# Altium schematic sheet Input&messenger.SchDoc
size A4
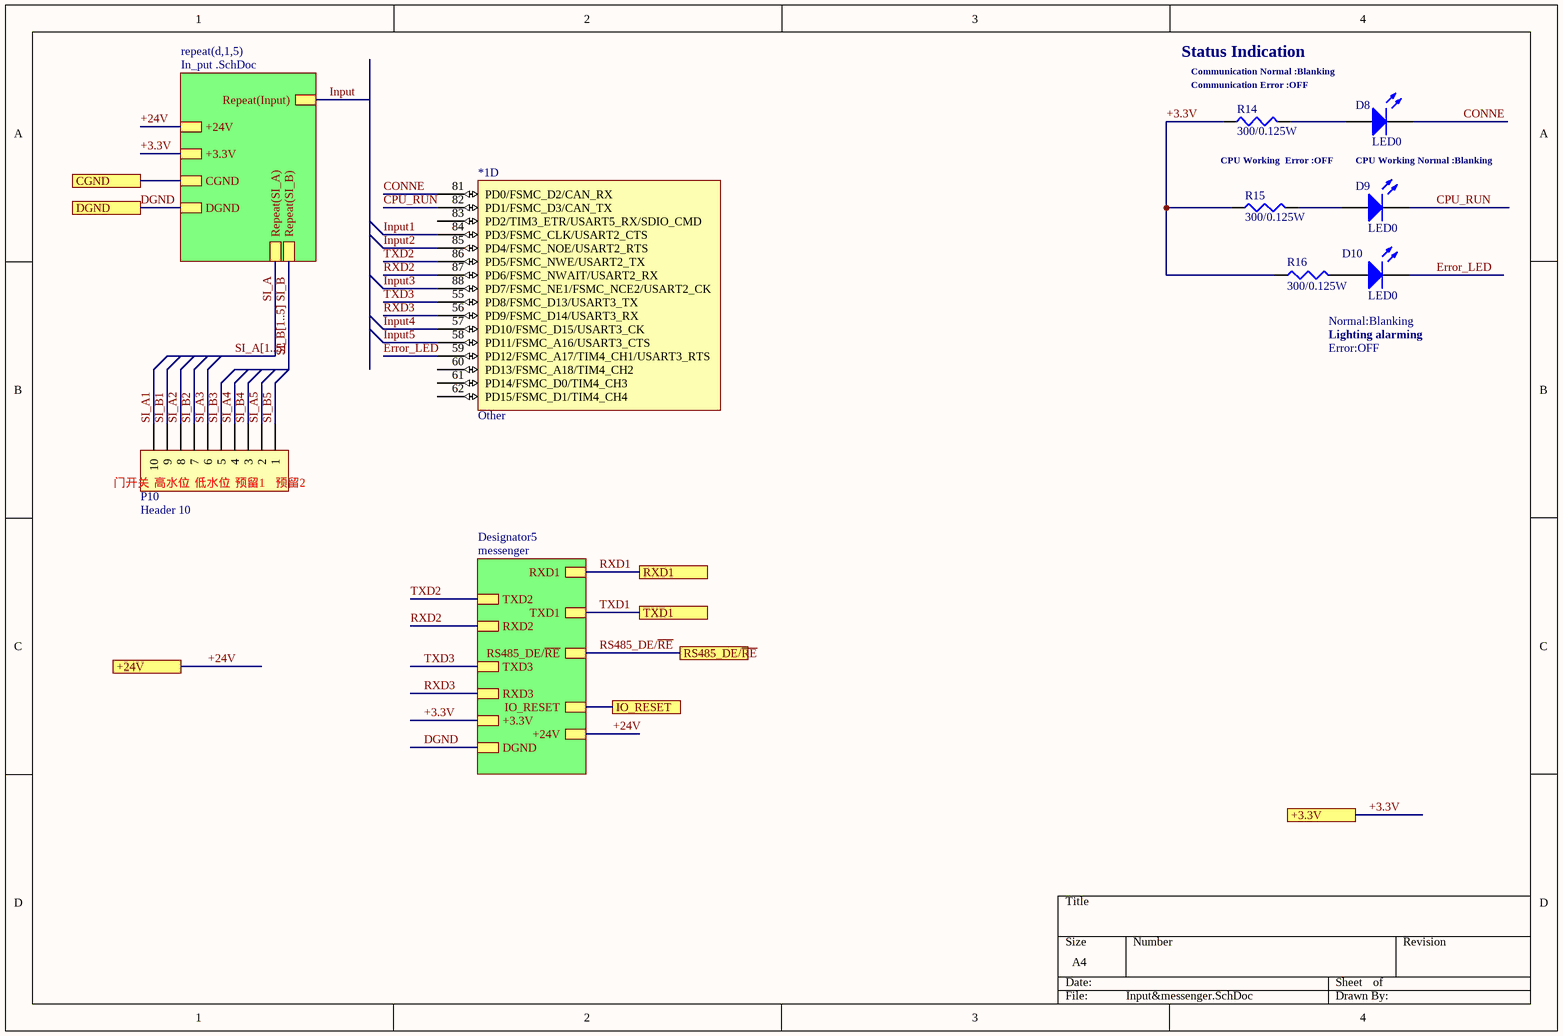
[diagram p0: Input&messenger.SchDoc]

## Parts
*1  Other  [STM-LQFP100_N]  (part D of 6)
D8  LED0  [0805LED]
D9  LED0  [0805LED]
D10  LED0  [0805LED]
P10  Header 10  [CONN-TH-KF7.62-10P]
R14  300/0.125W  [0805R]
R15  300/0.125W  [0805R]
R16  300/0.125W  [0805R]

## Sub-sheets
Designator5 = messenger: TXD2, RXD2, TXD3, RXD3, +3.3V, DGND, RXD1, TXD1, RS485_DE/~{RE}, +24V, IO_RESET
repeat(d,1,5) = In_put .SchDoc: Repeat(Input), +3.3V, CGND, DGND, +24V, Repeat(SI_A), Repeat(SI_B)

## Ports
+3.3V, +24V, CGND, DGND, IO_RESET, RS485_DE/~{RE}, RXD1, TXD1

## Nets
+3.3V: R14.1 R15.1 R16.1 ; port +3.3V, sheet repeat(d,1,5)/+3.3V, sheet Designator5/+3.3V
+24V: port +24V, sheet repeat(d,1,5)/+24V, sheet Designator5/+24V
CGND: port CGND, sheet repeat(d,1,5)/CGND
CONNE: *1.81(PD0/FSMC_D2/CAN_RX) D8.2(K)
CPU_RUN: *1.82(PD1/FSMC_D3/CAN_TX) D9.2(K)
DGND: port DGND, sheet repeat(d,1,5)/DGND, sheet Designator5/DGND
Error_LED: *1.59(PD12/FSMC_A17/TIM4_CH1/USART3_RTS) D10.2(K)
Input: sheet repeat(d,1,5)/Repeat(Input)
Input1: *1.84(PD3/FSMC_CLK/USART2_CTS)
Input2: *1.85(PD4/FSMC_NOE/USART2_RTS)
Input3: *1.88(PD7/FSMC_NE1/FSMC_NCE2/USART2_CK)
Input4: *1.57(PD10/FSMC_D15/USART3_CK)
Input5: *1.58(PD11/FSMC_A16/USART3_CTS)
IO_RESET: port IO_RESET, sheet Designator5/IO_RESET
RS485_DE/~{RE}: port RS485_DE/~{RE}, sheet Designator5/RS485_DE/~{RE}
RXD1: port RXD1, sheet Designator5/RXD1
RXD2: *1.87(PD6/FSMC_NWAIT/USART2_RX) ; sheet Designator5/RXD2
RXD3: *1.56(PD9/FSMC_D14/USART3_RX) ; sheet Designator5/RXD3
SI_A: sheet repeat(d,1,5)/Repeat(SI_A)
SI_A1: P10.10
SI_A2: P10.8
SI_A3: P10.6
SI_A4: P10.4
SI_A5: P10.2
SI_B: sheet repeat(d,1,5)/Repeat(SI_B)
SI_B1: P10.9
SI_B2: P10.7
SI_B3: P10.5
SI_B4: P10.3
SI_B5: P10.1
TXD1: port TXD1, sheet Designator5/TXD1
TXD2: *1.86(PD5/FSMC_NWE/USART2_TX) ; sheet Designator5/TXD2
TXD3: *1.55(PD8/FSMC_D13/USART3_TX) ; sheet Designator5/TXD3
NetD8_1: D8.1(A) R14.2
NetD9_1: D9.1(A) R15.2
NetD10_1: D10.1(A) R16.2

Not connected (* = marked no-connect by the designer): *1 60(PD13/FSMC_A18/TIM4_CH2) 61(PD14/FSMC_D0/TIM4_CH3) 62(PD15/FSMC_D1/TIM4_CH4) 83(PD2/TIM3_ETR/USART5_RX/SDIO_CMD)

## Buses and harness runs
bus SI_A[1..5]
bus SI_B[1..5]

## Notes on the sheet
- Status Indication
- Communication Normal :Blanking
- (near R14) Communication Error :OFF
- CPU Working  Error :OFF
- CPU Working Normal :Blanking
- Lighting alarming
- Normal:Blanking
- Error:OFF
- (near P10) 门开关
- (near P10) 高水位
- (near P10) 低水位
- (near P10) 预留1
- (near P10) 预留2

## Library data of the parts
*1 = stm32f103vct6
D8-D10 = LED0: 品牌： 国星光电  型号： NCD0805G1  发光颜色：翠绿 贴片LED；0805翠绿；2012翠绿；透镜颜色：无色透明；发光角度：130°；功率：72mW；工作温度：-30℃~+85℃； 尺寸2.0*1.25*1.1；IF=5ma：2.5~3.6v，525~537.5nm,180~400mcd 金线，光强高，功耗低，可靠性好，寿命长; Published: 8-Jun-2000; LatestRevisionDate: 08-Jul-2005; LatestRevisionNote: Mech Layer 1 removed.; PackageReference: LED-0; Publisher: Altium Limited; PackageDescription: LED; 2 Leads
P10 = Header 10: 品牌： KEFA(科发)  KF7.62-10p隔板类型：两面 间距：7.62mm 结构：1x2P 每排PIN数：2 排数：1 安装方式：直针 引脚位置：边脚 额定电流：24A 额定电压：450V 线规 - AWG：12~22 线规 - mm2：2.5 工作温度范围：-40℃~+105℃ 颜色：黑色 黑色; LatestRevisionDate: 17-Jul-2002; LatestRevisionNote: Re-released for DXP Platform.; Publisher: Altium Limited
R14-R16 = RES1: 品牌： UNI-ROYAL(厚声)    型号： 0805W8F3000T5E    电阻类型：厚膜电阻 阻值：300Ω 精度：±1% 功率：125mW 温度系数：±100ppm/℃